# Altium project my_first_project.PrjPcb (part 2 of 3)

## Sheet Microcontroller.SchDoc
size A3; SheetNumber: 4; SheetTotal: 5; FIRST_PROJECT: *FIRST_PROJECT; PAGE_SİZE: *A3
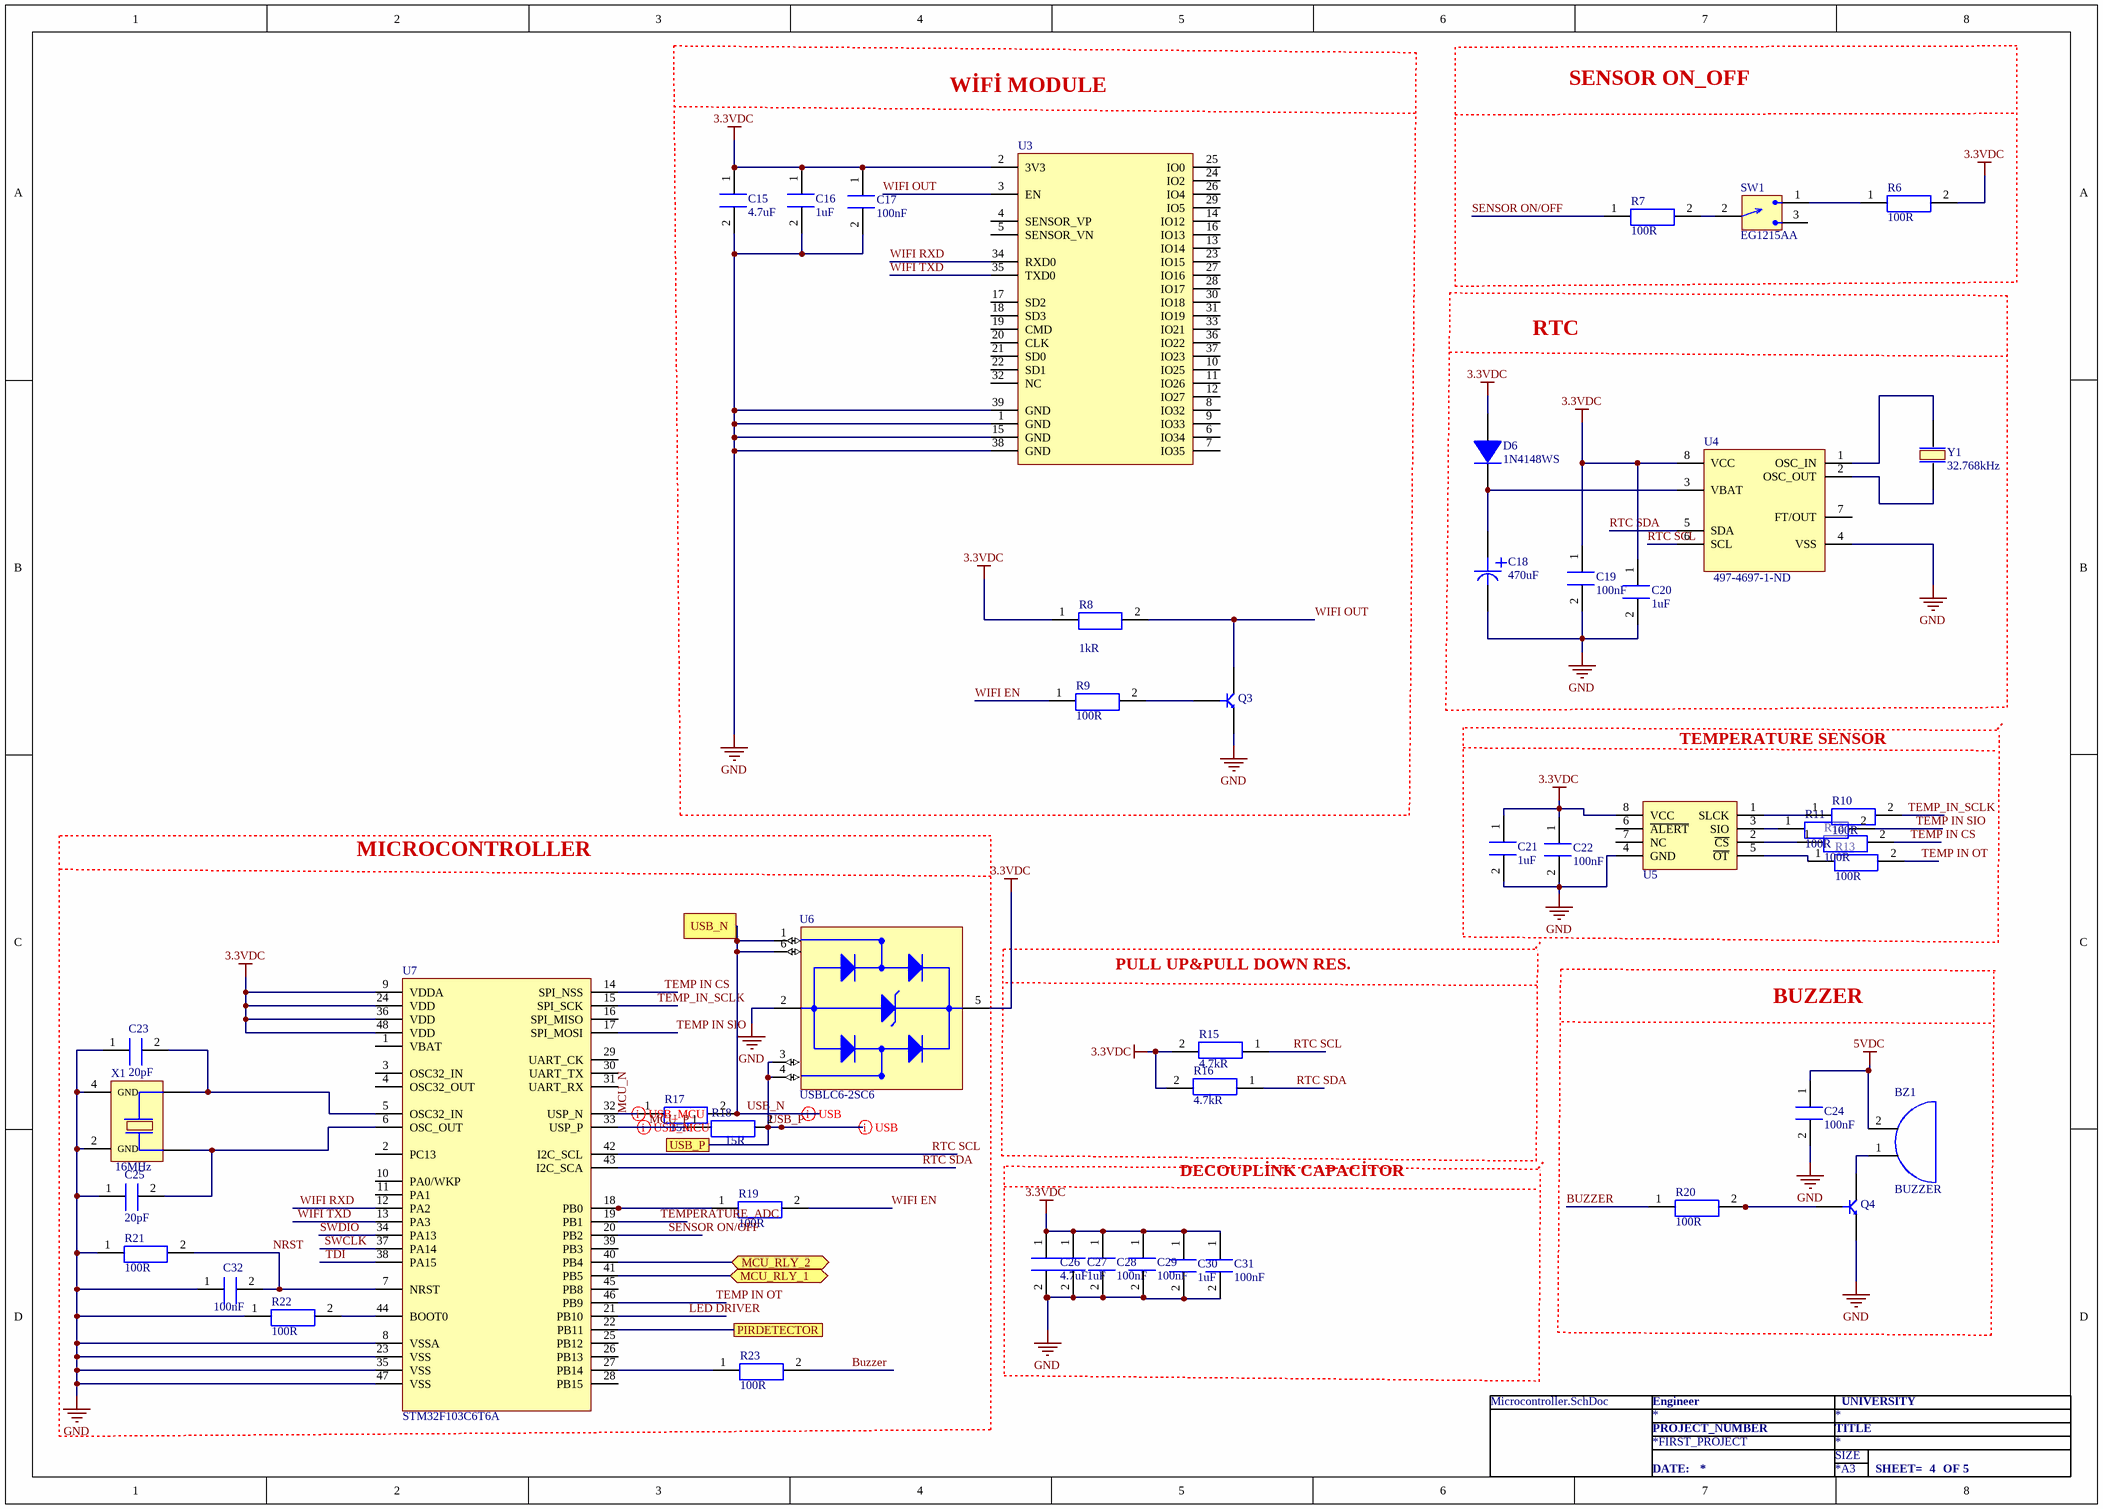
[diagram p3: Microcontroller.SchDoc]

### Parts
BZ1  BUZZER  [CMI-9605IC]
C15  Capacitance: 4.7uF  [CAP_0805]  (hidden comment: CAP CER 4.7uF 0805)
C16  Capacitance: 1uF  [CAP_0805]  (hidden comment: CAP CER 1UF 0805)
C17  Capacitance: 100nF  [CAP_0603]  (hidden comment: CAP CER 100nF 0603)
C18  Capacitance: 470uF  [CAP_RADIAL_D10_P5]  (hidden comment: ESH477M050AH4AA)
C19  Capacitance: 100nF  [CAP_0603]  (hidden comment: CAP CER 100nF 0603)
C20  Capacitance: 1uF  [CAP_0805]  (hidden comment: CAP CER 1UF 0805)
C21  Capacitance: 1uF  [CAP_0805]  (hidden comment: CAP CER 1UF 0805)
C22  Capacitance: 100nF  [CAP_0603]  (hidden comment: CAP CER 100nF 0603)
C23  Capacitance: 20pF  [CAP_0603]  (hidden comment: CL10C200JB8NNNC)
C24  Capacitance: 100nF  [CAP_0603]  (hidden comment: CAP CER 100nF 0603)
C25  Capacitance: 20pF  [CAP_0603]  (hidden comment: CL10C200JB8NNNC)
C26  Capacitance: 4.7uF  [CAP_0805]  (hidden comment: CAP CER 4.7uF 0805)
C27  Capacitance: 1uF  [CAP_0805]  (hidden comment: CAP CER 1UF 0805)
C28  Capacitance: 100nF  [CAP_0805]  (hidden comment: CAP CF 100NF 0805)
C29  Capacitance: 100nF  [CAP_0805]  (hidden comment: CAP CF 100NF 0805)
C30  Capacitance: 1uF  [CAP_0805]  (hidden comment: CAP CER 1UF 0805)
C31  Capacitance: 100nF  [CAP_0805]  (hidden comment: CAP CF 100NF 0805)
C32  Capacitance: 100nF  [CAP_0805]  (hidden comment: CAP CF 100NF 0805)
D6  1N4148WS  [SOD323]
Q3  MMBT3904-7-F  [SOT-23F]  (value not drawn)
Q4  MMBT3904-7-F  [SOT-23F]  (value not drawn)
R6  Resistance: 100R  [RES_0603]  (hidden comment: RES_100OHM_0603)
R7  Resistance: 100R  [RES_0603]  (hidden comment: RES_100OHM_0603)
R8  Resistance: 1kR  [RES_0603]  (hidden comment: RES_1KOHM)
R9  Resistance: 100R  [RES_0603]  (hidden comment: RES_100OHM_0603)
R10  Resistance: 100R  [RES_0603]  (hidden comment: RES_100OHM_0603)
R11  Resistance: 100R  [RES_0603]  (hidden comment: RES_100OHM_0603)
R12  Resistance: 100R  [RES_0603]  (hidden comment: RES_100OHM_0603)
R13  Resistance: 100R  [RES_0603]  (hidden comment: RES_100OHM_0603)
R15  Resistance: 4.7kR  [RES_0603]  (hidden comment: RES_4.7KOHM 0603)
R16  Resistance: 4.7kR  [RES_0603]  (hidden comment: RES_4.7KOHM 0603)
R17  Resistance: 15R  [RES_0603]  (hidden comment: RES 15 OHM 0603)
R18  Resistance: 15R  [RES_0603]  (hidden comment: RES 15 OHM 0603)
R19  Resistance: 100R  [RES_0603]  (hidden comment: RES_100OHM_0603)
R20  Resistance: 100R  [RES_0603]  (hidden comment: RES_100OHM_0603)
R21  Resistance: 100R  [RES_0603]  (hidden comment: RES_100OHM_0603)
R22  Resistance: 100R  [RES_0603]  (hidden comment: RES_100OHM_0603)
R23  Resistance: 100R  [RES_0603]  (hidden comment: RES_100OHM_0603)
SW1  EG1215AA  [EG1215AA]
U3  ESP32-WROOM-32E-N4  [ESP32-32E]  (value not drawn)
U4  Supplier Part Number 1: 497-4697-1-ND  [SOIC8]  (hidden comment: M41T00M6F)
U5  MAX662MSA+  [SOIC8]  (value not drawn)
U6  USBLC6-2SC6  [SOT-23-6L]
U7  STM32F103C6T6A  [LQFP_48]
X1  Frequency: 16MHz  [ECS]  (hidden comment: ECS-160-20-30B-TR)
Y1  Frequency: 32.768kHz  [ABS05]  (hidden comment: ABS05-32.768KHZ-T)

### Blocks framed on the sheet
WİFİ MODULE: C15-C17 Q3 R8 R9 U3
SENSOR ON_OFF: R6 R7 SW1
RTC: C18-C20 D6 U4 Y1
MICROCONTROLLER: C23 C25 C32 R17-R19 R21-R23 U6 U7 X1
BUZZER: BZ1 C24 Q4 R20

### Ports
MCU_RLY_1 (bidir), MCU_RLY_2 (bidir), PIRDETECTOR, USB_N, USB_P

### Nets
3.3VDC: C15.1 C16.1 C17.1 C19.1 C20.1 C21.1 C22.1 C26.1 C27.1 C28.1 C29.1 C30.1 C31.1 D6.2 R6.2 R8.1 R15.2 R16.2 U3.2(3V3) U4.8(VCC) U5.8(VCC) U6.5(VBUS) U7.9(VDDA) U7.24(VDD) U7.36(VDD) U7.48(VDD)
5VDC: BZ1.2(GND) C24.1
GND: C15.2 C16.2 C17.2 C18.2 C19.2 C20.2 C21.2 C22.2 C23.1 C24.2 C25.1 C26.2 C27.2 C28.2 C29.2 C30.2 C31.2 C32.1 Q3.2(E) Q4.2(E) R21.1 R22.1 U3.1(GND) U3.15(GND) U3.38(GND) U3.39(GND) U4.4(VSS) U5.4(GND) U6.2(GND) U7.8(VSSA) U7.23(VSS) U7.35(VSS) U7.47(VSS) X1.2(GND) X1.4(GND)
BUZZER: R20.1 R23.2
LED DRIVER: U7.21(PB10)
MCU_N: R17.1 U7.32(USP_N)
MCU_P: R18.1 U7.33(USP_P)
NRST: C32.2 R21.2 U7.7(NRST)
RTC SCL: R15.1 U4.6(SCL) U7.42(I2C_SCL)
RTC SDA: R16.1 U4.5(SDA) U7.43(I2C_SCA)
SENSOR ON/OFF: R7.1 U7.20(PB2)
SWCLK: U7.37(PA14)
SWDIO: U7.34(PA13)
TDI: U7.38(PA15)
TEMP IN CS: R12.2 U7.14(SPI_NSS)
TEMP IN OT: R13.2 U7.46(PB9)
TEMP IN SIO: R11.2 U7.17(SPI_MOSI)
TEMP_IN_SCLK: R10.2 U7.15(SPI_SCK)
TEMPERATURE_ADC: U7.19(PB1)
USB_N: R17.2 U6.1(I/O1_IN) U6.6(I/O1_OUT) ; port USB_N
USB_P: R18.2 U6.3(I/O2_IN) U6.4(I/O2_OUT) ; port USB_P
WIFI EN: R9.1 R19.2
WIFI OUT: Q3.3(C) R8.2 U3.3(EN)
WIFI RXD: U3.34(RXD0) U7.12(PA2)
WIFI TXD: U3.35(TXD0) U7.13(PA3)
NetBZ1_1: BZ1.1(VDC) Q4.3(C)
NetC18_1: C18.1 D6.1 U4.3(VBAT)
NetC23_2: C23.2 U7.5(OSC32_IN) X1.3
NetC25_2: C25.2 U7.6(OSC_OUT) X1.1
NetJ8_5: U7.22(PB11) ; port PIRDETECTOR
NetQ3_1: Q3.1(B) R9.2
NetQ4_1: Q4.1(B) R20.2
NetR2_1: U7.41(PB5) ; port MCU_RLY_1
NetR4_1: U7.40(PB4) ; port MCU_RLY_2
NetR6_1: R6.1 SW1.1
NetR7_2: R7.2 SW1.2
NetR10_1: R10.1 U5.1(SLCK)
NetR11_1: R11.1 U5.3(SIO)
NetR12_1: R12.1 U5.2(~{CS})
NetR13_1: R13.1 U5.5(~{OT})
NetR19_1: R19.1 U7.18(PB0)
NetR22_2: R22.2 U7.44(BOOT0)
NetR23_1: R23.1 U7.27(PB14)
NetU4_1: U4.1(OSC_IN) Y1.2
NetU4_2: U4.2(OSC_OUT) Y1.1

Not connected (* = marked no-connect by the designer): SW1 3; U3 4(SENSOR_VP) 5(SENSOR_VN) 6(IO34) 7(IO35) 8(IO32) 9(IO33) 10(IO25) 11(IO26) 12(IO27) 13(IO14) 14(IO12) 16(IO13) 17(SD2) 18(SD3) 19(CMD) 20(CLK) 21(SD0) 22(SD1) 23(IO15) 24(IO2) 25(IO0) 26(IO4) 27(IO16) 28(IO17) 29(IO5) 30(IO18) 31(IO19) 32(NC) 33(IO21) 36(IO22) 37(IO23); U4 7(FT/OUT); U5 6(~{ALERT}) 7(NC); U7 1(VBAT) 2(PC13) 3(OSC32_IN) 4(OSC32_OUT) 10(PA0/WKP) 11(PA1) 16(SPI_MISO) 25(PB12) 26(PB13) 28(PB15) 29(UART_CK) 30(UART_TX) 31(UART_RX) 39(PB3) 45(PB8)

### Layout directives
differential pair: MCU_N, MCU_P, USB_N, USB_P

### Notes on the sheet
- TEMPERATURE SENSOR
- PULL UP&PULL DOWN RES.
- DECOUPLİNK CAPACİTOR
- Engineer
- PROJECT_NUMBER
- SIZE
- TITLE
- UNIVERSITY
- DATE:
- SHEET=
- OF

### Library data of the parts
BZ1 = BUZZER: Audio Buzzer Magnetic 3VDC 7VDC 30mA 5VDC 85dB 2600Hz to 2800Hz Through Hole Pin Box; Manufacturer: CUI Devices; Manufacturer Part Number: CMI-9605IC-0580T; this part is design: alperen; Supplier 1: Digi-Key; RoHS: No; Category: Audio Products; Stock 1: 8015; Pricing 1: 1=1.43000, 10=1.19000, 25=1.10160, 50=1.03700, 100=0.97450, 500=0.83848, 1000=0.78382, 5000=0.76810 (USD); Supplier Part Number 1: 2223-CMI-9605IC-0580T-ND; Case/Package: CMI-960
C15 C26 = CAP CER 4.7uF 0805: CAP CER 4.7UF 25V X5R 0805; Manufacturer: Samsung; Manufacturer Part Number: CL21A475KAQNNNE; this part is design: alperen; Tolerance: 10%; Supplier 1: Digi-Key; RoHS: Yes; Category: Ceramic Capacitors; Stock 1: 4696474; Pricing 1: 1=0.10000, 10=0.07300, 50=0.04140, 100=0.03440, 500=0.02408, 1000=0.01994 (USD); Mount: Surface Mount; Case/Package: 0805; Case Code (Metric): 2012; Case Code (Imperial): 0805; Min Operating Temperature: -55°C; Max Operating Temperature: 85°C; Package Quantity: 1; Packaging: Tape and Reel; Voltage Rating: 25V; Dielectric: X5R; Voltage Rating (DC): 25V; Series: CL; Construction: Flat; Length: 2mm; Width: 0.049inch; Height: 1.25mm; Thickness: 0.055inch; Depth: 1.25mm; Radiation Hardening: No; Lead Free: Lead Free; RoHS Compliant: Yes; ComponentLink1URL: https://datasheet.ciiva.com/25798/cl21a475kaqnnne-25798882.pdf?src-supplier=Digi-Key; ComponentLink1Description: https://datasheet.ciiva.com/25798/cl21a475kaqnnne-25798882.pdf?src-supplier=Digi-Key; Supplier Part Number 1: 1276-1244-6-ND
C16 C20 C21 C27 C30 = CAP CER 1UF 0805: CAP CER 1UF 25V X5R 0805; Manufacturer: Murata; Manufacturer Part Number: GRM216R61E105KA12D; this part is design: alperen; Material: Ceramic; Tolerance: 10%; Supplier 1: Digi-Key; RoHS: Yes; Category: Ceramic Capacitors; Stock 1: 601950; Pricing 1: 1=0.38000, 10=0.26600, 50=0.18640, 100=0.15970, 500=0.11980, 1000=0.10116 (USD); Mount: Surface Mount; Case/Package: 0805; Number of Pins: 2; Case Code (Imperial): 0805; Case Code (Metric): 2012; Min Operating Temperature: -55°C; Max Operating Temperature: 85°C; Voltage Rating: 25V; Packaging: Tape and Reel; Dielectric: X5R; Package Quantity: 1; Termination: SMD/SMT; Voltage Rating (DC): 25V; Series: GRM; Construction: Flat; Voltage: 25V; Length: 2mm; Width: 1.25mm; Height: 0.6mm; Thickness: 0.028inch; Depth: 1.25mm; Radiation Hardening: No; RoHS Compliant: Yes; Lead Free: Lead Free; Reach SVHC Compliant: Yes; ComponentLink1URL: https://datasheet.ciiva.com/5424/product-5424880.pdf?src-supplier=Mouser; ComponentLink1Description: https://datasheet.ciiva.com/5424/product-5424880.pdf?src-supplier=Mouser; ComponentLink2URL: https://datasheet.ciiva.com/3777/337grm216r61e105ka1223-3777289.pdf?src-supplier=Arrow+Electronics; ComponentLink2Description: https://datasheet.ciiva.com/3777/337grm216r61e105ka1223-3777289.pdf?src-supplier=Arrow+Electronics; ComponentLink3URL: https://datasheet.ciiva.com/11787/0900766b80ef921d-11787891.pdf?src-supplier=Rs; ComponentLink3Description: https://datasheet.ciiva.com/11787/0900766b80ef921d-11787891.pdf?src-supplier=Rs; ComponentLink4URL: https://datasheet.ciiva.com/7719/c02e-7719049.pdf?src-supplier=Element14; ComponentLink4Description: https://datasheet.ciiva.com/7719/c02e-7719049.pdf?src-supplier=Element14; ComponentLink5URL: https://datasheet.ciiva.com/22706/1889704-22706791.pdf?src-supplier=Element14; ComponentLink5Description: https://datasheet.ciiva.com/22706/1889704-22706791.pdf?src-supplier=Element14; ComponentLink6URL: https://datasheet.ciiva.com/138/partnumbering-e-01-138518.pdf?src-supplier=Digi-Key; ComponentLink6Description: https://datasheet.ciiva.com/138/partnumbering-e-01-138518.pdf?src-supplier=Digi-Key; ComponentLink7URL: https://datasheet.ciiva.com/138/partnumbering-e-01-138517.pdf?src-supplier=Digi-Key; ComponentLink7Description: https://datasheet.ciiva.com/138/partnumbering-e-01-138517.pdf?src-supplier=Digi-Key; ComponentLink8URL: https://datasheet.ciiva.com/138/partnumbering-e-01-138519.pdf?src-supplier=Digi-Key; ComponentLink8Description: https://datasheet.ciiva.com/138/partnumbering-e-01-138519.pdf?src-supplier=Digi-Key; ComponentLink9URL: https://datasheet.ciiva.com/2989/product-2989638.pdf?src-supplier=Avnet; ComponentLink9Description: https://datasheet.ciiva.com/2989/product-2989638.pdf?src-supplier=Avnet; Supplier Part Number 1: 490-1700-1-ND
C17 C19 C22 C24 = CAP CER 100nF 0603: Multilayer Ceramic Capacitor, 0.1 uF, 10 V, ± 10%, X5R, 0402 [1005 Metric] %10; this part is design: alperen; Manufacturer: KEMET; Manufacturer Part Number: C0402C104K8PACTU; Voltage Rating: 10V; Dissipation Factor: 5%; Supplier 1: Digi-Key; RoHS: Yes; Category: Ceramic Capacitors; Stock 1: 2730000; Pricing 1: 10000=0.00702, 20000=0.00669, 30000=0.00635, 50000=0.00568, 100000=0.00460 (USD); Mount: Surface Mount,PCB; Case/Package: 0402; Number of Pins: 2; Case Code (Metric): 1005; Case Code (Imperial): 0402; Dielectric Material: Ceramic; Contact Plating: Tin,Matte; Min Operating Temperature: -55°C; Max Operating Temperature: 85°C; Tolerance: 10%; Voltage Rating (DC): 10V; Package Quantity: 10000; Packaging: Tape and Reel; Termination: SMD/SMT; Voltage: 10V; Series: SMD Comm X5R; Construction: Flat; Dielectric: X5R; Length: 1mm; Width: 0.5mm; Height: 0.5mm; Depth: 0.5mm; Thickness: 0.022inch; Lead Pitch: 0.3mm; Radiation Hardening: No; RoHS Compliant: Yes; Reach SVHC Compliant: Yes; Lead Free: Lead Free; Supplier Part Number 1: 399-C0402C104K8PAC7867TR-ND
C18 = ESH477M050AH4AA: Cap, 470UF, 50V, Alu Elec, Radial; Manufacturer: KEMET; this part is design: alperen; Polarity: Polar; Tolerance: 20%; Life (Hours): 2000Hour; Supplier 1: Digi-Key; Manufacturer Part Number: ESH477M050AH4AA; RoHS: Yes; Pricing 1: 1=0.73000, 10=0.51800, 50=0.39180, 100=0.34120, 500=0.25276, 1000=0.21485, 2500=0.20222, 5000=0.18958 (USD); Mount: Through Hole; Case/Package: Radial; Min Operating Temperature: -40°C; Max Operating Temperature: 105°C; Packaging: Bulk; Voltage Rating: 50V; RoHS Compliant: No; ComponentLink1URL: https://api.kemet.com/component-edge/download/datasheet/ESH477M050AH4AA.pdf?src-supplier=Digi-Key; ComponentLink1Description: https://api.kemet.com/component-edge/download/datasheet/ESH477M050AH4AA.pdf?src-supplier=Digi-Key; Supplier Part Number 1: 399-15683-ND
C23 C25 = CAP CER 20pF 0603: CAP CER 20PF 50V C0G/NP0 0603; this part is designed: alperen; Manufacturer: Samsung; Tolerance: 5%; Dielectric: C0G; Temperature Coefficient: 300ppm/°C; Supplier 1: Digi-Key; Manufacturer Part Number: CL10C200JB8NNNC; RoHS: Yes; Category: Ceramic Capacitors; Stock 1: 512055; Pricing 1: 1=0.10000, 10=0.04400, 50=0.02380, 100=0.01940, 500=0.01386, 1000=0.01089 (USD); Mount: Surface Mount; Case/Package: 0603; Case Code (Metric): 1608; Case Code (Imperial): 0603; Min Operating Temperature: -55°C; Max Operating Temperature: 125°C; Package Quantity: 1; Packaging: Tape and Reel; Voltage Rating: 50V; Voltage: 50V; Series: CL; Construction: Flat; Length: 1.6mm; Width: 0.031inch; Height: 0.8mm; Thickness: 0.035inch; Depth: 0.8mm; Radiation Hardening: No; RoHS Compliant: Yes; ComponentLink1URL: https://datasheet.ciiva.com/26877/getdatasheetpartid-640634-26877974.pdf?src-supplier=Verical; ComponentLink1Description: https://datasheet.ciiva.com/26877/getdatasheetpartid-640634-26877974.pdf?src-supplier=Verical; ComponentLink2URL: https://datasheet.ciiva.com/26310/mlcc-catalogdownload2013-eng-26310315.pdf?src-supplier=Distrelec; ComponentLink2Description: https://datasheet.ciiva.com/26310/mlcc-catalogdownload2013-eng-26310315.pdf?src-supplier=Distrelec; Supplier Part Number 1: 1276-1187-1-ND
C28 C29 C31 C32 = CAP CF 100NF 0805: CAP CER 0.1UF 50V X7R 0805; Manufacturer: Samsung; Manufacturer Part Number: CL21B104KBCNNNC; this part is design: alperen; Material: Ceramic; Tolerance: 10%; Supplier 1: Digi-Key; RoHS: Yes; Category: Ceramic Capacitors; Stock 1: 3449370; Pricing 1: 1=0.10000, 10=0.04400, 50=0.02400, 100=0.01960, 500=0.01404, 1000=0.01103 (USD); Mount: Surface Mount; Case/Package: 0805; Case Code (Metric): 2012; Case Code (Imperial): 0805; Contact Plating: Tin; Min Operating Temperature: -55°C; Max Operating Temperature: 125°C; Dielectric: X7R; Packaging: Tape and Reel; Voltage Rating: 50V; Voltage: 50V; Voltage Rating (DC): 50V; Series: CL; Construction: Flat; Length: 2mm; Width: 0.049inch; Height: 0.85mm; Depth: 1.25mm; Thickness: 0.037inch; Radiation Hardening: No; Lead Free: Lead Free; RoHS Compliant: Yes; ComponentLink1URL: https://datasheet.ciiva.com/25710/cl21b104kbcnnnc-25710182.pdf?src-supplier=Digi-Key; ComponentLink1Description: https://datasheet.ciiva.com/25710/cl21b104kbcnnnc-25710182.pdf?src-supplier=Digi-Key; ComponentLink2URL: https://datasheet.ciiva.com/29199/454152-da-01-en-vs-kondensator-0805-29199814.pdf?src-supplier=Conrad; ComponentLink2Description: https://datasheet.ciiva.com/29199/454152-da-01-en-vs-kondensator-0805-29199814.pdf?src-supplier=Conrad; Supplier Part Number 1: 1276-1003-1-ND
D6 = 1N4148WS: VR=75V IF=150mA Trr=4ns P=200mW; Manufacturer: ON Semiconductor / Fairchild; this part is design: alperen; Forward Current: 150mA; Reverse Recovery Time: 4ns; Max Repetitive Reverse Voltage (Vrrm): 75V; Power Dissipation: 200mW; Max Reverse Current: 5uA; Forward Voltage: 1V; Max Forward Surge Current (Ifsm): 2A; Element Configuration: Single; Supplier 1: Digi-Key; Manufacturer Part Number: 1N4148WS; RoHS: Yes; Category: Rectifier Diodes; Stock 1: 878888; Pricing 1: 1=0.21000, 10=0.19200, 100=0.10460, 500=0.06436, 1000=0.04388 (USD); Mount: Surface Mount; Number of Pins: 2; Contact Plating: Tin,Matte; Weight: 0.0276g; Min Operating Temperature: -55°C; Max Operating Temperature: 150°C; Packaging: Tape and Reel; Package Quantity: 1; Recovery Time: 4ns; Average Rectified Current: 150mA; Reverse Voltage: 75V; Max Reverse Voltage (DC): 75V; Series: -; Length: 1.8mm; Width: 1.35mm; Height: 1mm; Radiation Hardening: No; Reach SVHC Compliant: Yes; Lead Free: Lead Free; RoHS Compliant: Yes; ComponentLink1URL: https://datasheet.ciiva.com/15208/getdatasheetpartid-127819-15208358.pdf?src-supplier=Verical; ComponentLink1Description: https://datasheet.ciiva.com/15208/getdatasheetpartid-127819-15208358.pdf?src-supplier=Verical; ComponentLink2URL: https://datasheet.ciiva.com/8300/1n914bws-8300360.pdf?src-supplier=Avnet; ComponentLink2Description: https://datasheet.ciiva.com/8300/1n914bws-8300360.pdf?src-supplier=Avnet; Supplier Part Number 1: 1N4148WSFSCT-ND
Q3 Q4 = MMBT3904-7-F: NPN Ic=200mA Vceo=40V hfe=100~300 fT=310MHz P=300mW SOT-23; this part is designed: alperen; Manufacturer: Diodes Zetex; Max Power Dissipation: 300mW; Collector Emitter Voltage (VCEO): 40V; Max Collector Current: 200mA; Collector Base Voltage (VCBO): 60V; Power Dissipation: 350mW; Frequency: 300MHz; hFE Min: 100; Number of Elements: 1; Emitter Base Voltage (VEBO): 6V; Collector Emitter Saturation Voltage: 300mV; Element Configuration: Single; Supplier 1: Digi-Key; Manufacturer Part Number: MMBT3904-7-F; RoHS: Yes; Category: BJTs; Stock 1: 7702566; Pricing 1: 1=0.13000, 10=0.11700, 100=0.06370, 500=0.03918, 1000=0.02671 (USD); Mount: Surface Mount; Case/Package: SOT-23; Number of Pins: 3; Weight: 0.000282oz; Contact Plating: Tin,Matte; Min Operating Temperature: -55°C; Max Operating Temperature: 150°C; Polarity: NPN; Packaging: Tape and Reel; Package Quantity: 3000; Transition Frequency: 300MHz; Collector Emitter Breakdown Voltage: 40V; Max Breakdown Voltage: 40V; Continuous Collector Current: 200mA; Max Frequency: 300MHz; Gain Bandwidth Product: 300MHz; Voltage Rating (DC): 40V; Series: Automotive, AEC-Q101; Collector-emitter Voltage-Max: 300mV; Length: 3.05mm; Width: 1.4mm; Height: 1mm; Radiation Hardening: No; Reach SVHC Compliant: Yes; Lead Free: Lead Free; RoHS Compliant: Yes; ComponentLink1URL: https://datasheet.ciiva.com/11201/ds30036-11201778.pdf?src-supplier=Avnet; ComponentLink1Description: https://datasheet.ciiva.com/11201/ds30036-11201778.pdf?src-supplier=Avnet; ComponentLink2URL: https://datasheet.ciiva.com/15138/getdatasheetpartid-53265-15138780.pdf?src-supplier=Verical; ComponentLink2Description: https://datasheet.ciiva.com/15138/getdatasheetpartid-53265-15138780.pdf?src-supplier=Verical; ComponentLink3URL: https://datasheet.ciiva.com/22711/1915516-22711750.pdf?src-supplier=Element14; ComponentLink3Description: https://datasheet.ciiva.com/22711/1915516-22711750.pdf?src-supplier=Element14; ComponentLink4URL: https://datasheet.ciiva.com/11198/ds30036-11198999.pdf?src-supplier=Avnet; ComponentLink4Description: https://datasheet.ciiva.com/11198/ds30036-11198999.pdf?src-supplier=Avnet; ComponentLink5URL: https://datasheet.ciiva.com/6361/ds30036-6361256.pdf?src-supplier=Digi-Key; ComponentLink5Description: https://datasheet.ciiva.com/6361/ds30036-6361256.pdf?src-supplier=Digi-Key; ComponentLink6URL: https://datasheet.ciiva.com/6361/ds30036-6361254.pdf?src-supplier=Digi-Key; ComponentLink6Description: https://datasheet.ciiva.com/6361/ds30036-6361254.pdf?src-supplier=Digi-Key; Supplier Part Number 1: MMBT3904-FDICT-ND
R6 R7 R9-R13 R19-R23 = RES_100OHM_0603: Res Thick Film 0603 100 Ohm 1% 1/10W ±100ppm/°C Molded SMD Paper T/R; this part is design: alperen; Manufacturer: Vishay Dale; Manufacturer Part Number: CRCW0603100RFKEA; Max Power Dissipation: 100mW; Voltage Rating: 75V; Supplier 1: Digi-Key; RoHS: Yes; Category: Chip SMD Resistors; Stock 1: 9146; Pricing 1: 1=0.10000, 10=0.03800, 100=0.01560, 1000=0.00701, 2500=0.00608 (USD); Mount: Surface Mount; Case/Package: 0603; Number of Pins: 2; Case Code (Metric): 1608; Case Code (Imperial): 0603; Contact Plating: Tin; Size Code: 0603; Weight: 7.1E-05oz; Min Operating Temperature: -55°C; Max Operating Temperature: 155°C; Packaging: Tape and Reel; Temperature Coefficient: 100ppm/°C; Tolerance: 1%; Series: CRCW; Resistor Type: Thick Film; Number of Terminations: 2; Power Rating: 100mW; Features: Automotive AEC-Q200; Construction: Rectangular; Termination: SMD/SMT; Package Quantity: 10; Voltage Rating (DC): 75V; Resistance Tolerance: 1%; Length: 1.55mm; Width: 0.033inch; Height: 0.02inch; Depth: 0.85mm; Ratings: AEC-Q200; Radiation Hardening: No; RoHS Compliant: Yes; Military Standard: Not; Lead Free: Lead Free; ComponentLink1URL: https://datasheet.ciiva.com/22666/1720486-22666207.pdf?src-supplier=Element14; ComponentLink1Description: https://datasheet.ciiva.com/22666/1720486-22666207.pdf?src-supplier=Element14; ComponentLink2URL: https://datasheet.ciiva.com/26316/fld-crcw-e3-data-en-26316566.pdf?src-supplier=Distrelec; ComponentLink2Description: https://datasheet.ciiva.com/26316/fld-crcw-e3-data-en-26316566.pdf?src-supplier=Distrelec; ComponentLink3URL: https://datasheet.ciiva.com/22673/1697337-22673066.pdf?src-supplier=Element14; ComponentLink3Description: https://datasheet.ciiva.com/22673/1697337-22673066.pdf?src-supplier=Element14; ComponentLink4URL: https://datasheet.ciiva.com/2465/dcrcwe3-2465544.pdf?src-supplier=Digi-Key; ComponentLink4Description: https://datasheet.ciiva.com/2465/dcrcwe3-2465544.pdf?src-supplier=Digi-Key; ComponentLink5URL: https://datasheet.ciiva.com/2465/dcrcwe3-2465545.pdf?src-supplier=Digi-Key; ComponentLink5Description: https://datasheet.ciiva.com/2465/dcrcwe3-2465545.pdf?src-supplier=Digi-Key; ComponentLink6URL: https://datasheet.ciiva.com/2465/dcrcwe3-2465543.pdf?src-supplier=Digi-Key; ComponentLink6Description: https://datasheet.ciiva.com/2465/dcrcwe3-2465543.pdf?src-supplier=Digi-Key; ComponentLink7URL: https://datasheet.ciiva.com/16721/70201119-16721486.pdf?src-supplier=Allied+Electronics; ComponentLink7Description: https://datasheet.ciiva.com/16721/70201119-16721486.pdf?src-supplier=Allied+Electronics; ComponentLink8URL: https://datasheet.ciiva.com/16787/70201119-16787964.pdf?src-supplier=Allied+Electronics; ComponentLink8Description: https://datasheet.ciiva.com/16787/70201119-16787964.pdf?src-supplier=Allied+Electronics; ComponentLink9URL: https://datasheet.ciiva.com/5550/dcrcwe3-109170-5550286.pdf?src-supplier=Mouser; ComponentLink9Description: https://datasheet.ciiva.com/5550/dcrcwe3-109170-5550286.pdf?src-supplier=Mouser; ComponentLink10URL: https://datasheet.ciiva.com/16199/dcrcwe3-16199102.pdf?src-supplier=Future+Electronics; ComponentLink10Description: https://datasheet.ciiva.com/16199/dcrcwe3-16199102.pdf?src-supplier=Future+Electronics; Supplier Part Number 1: 541-100HCT-ND
R8 = RES_1KOHM: Res Thin Film 0603 1K Ohm 0.1% 1/10W ±25ppm/°C Molded SMD SMD Punched Carrier T/R; this part is designed: alperen; Manufacturer: Panasonic; Manufacturer Part Number: ERA-3AEB102V; Power Rating: 100mW; Voltage Rating: 75V; Supplier 1: Digi-Key; RoHS: Yes; Category: Chip SMD Resistors; Stock 1: 5000; Pricing 1: 1=0.35000, 10=0.29900, 100=0.11670, 500=0.07056, 1000=0.04885, 2500=0.04478 (USD); Mount: Surface Mount; Case/Package: 0603; Number of Pins: 2; Case Code (Imperial): 0603; Case Code (Metric): 1608; Contact Plating: Tin; Size Code: 0603; Min Operating Temperature: -55°C; Max Operating Temperature: 155°C; Packaging: Tape and Reel; Temperature Coefficient: 25ppm/°C; Series: ERA-3A; Tolerance: 0.1%; Resistor Type: Thin Film; Number of Terminations: 2; Max Power Dissipation: 100mW; Construction: Rectangular; Features: Automotive AEC-Q200; Package Quantity: 5000; Termination: SMD/SMT; Resistance Tolerance: 0.1%; Technology: METAL FILM; Length: 1.6mm; Width: 0.8mm; Height: 0.45mm; Depth: 0.8mm; Ratings: AEC-Q200; Radiation Hardening: No; RoHS Compliant: Yes; Military Standard: Not; Reach SVHC Compliant: Yes; ComponentLink1URL: https://datasheet.ciiva.com/29183/450752-da-01-en-widerstand-0603-era-29183754.pdf?src-supplier=Conrad; ComponentLink1Description: https://datasheet.ciiva.com/29183/450752-da-01-en-widerstand-0603-era-29183754.pdf?src-supplier=Conrad; ComponentLink2URL: https://datasheet.ciiva.com/46393/1776116-46393695.pdf?src-supplier=Element14; ComponentLink2Description: https://datasheet.ciiva.com/46393/1776116-46393695.pdf?src-supplier=Element14; ComponentLink3URL: https://datasheet.ciiva.com/5734/aoa0000ce26-5734524.pdf?src-supplier=Farnell; ComponentLink3Description: https://datasheet.ciiva.com/5734/aoa0000ce26-5734524.pdf?src-supplier=Farnell; ComponentLink4URL: https://datasheet.ciiva.com/46422/1776116-46422455.pdf?src-supplier=Element14; ComponentLink4Description: https://datasheet.ciiva.com/46422/1776116-46422455.pdf?src-supplier=Element14; ComponentLink5URL: https://datasheet.ciiva.com/48530/era-eng-tds-48530582.pdf?src-supplier=Distrelec; ComponentLink5Description: https://datasheet.ciiva.com/48530/era-eng-tds-48530582.pdf?src-supplier=Distrelec; ComponentLink6URL: https://datasheet.ciiva.com/46422/485442-46422519.pdf?src-supplier=Element14; ComponentLink6Description: https://datasheet.ciiva.com/46422/485442-46422519.pdf?src-supplier=Element14; ComponentLink7URL: https://datasheet.ciiva.com/5734/485442-5734525.pdf?src-supplier=Farnell; ComponentLink7Description: https://datasheet.ciiva.com/5734/485442-5734525.pdf?src-supplier=Farnell; ComponentLink8URL: https://datasheet.ciiva.com/28531/485442-28531944.pdf?src-supplier=Element14; ComponentLink8Description: https://datasheet.ciiva.com/28531/485442-28531944.pdf?src-supplier=Element14; ComponentLink9URL: https://datasheet.ciiva.com/24071/aoa0000ce26-197354-24071510.pdf?src-supplier=Mouser; ComponentLink9Description: https://datasheet.ciiva.com/24071/aoa0000ce26-197354-24071510.pdf?src-supplier=Mouser; ComponentLink10URL: https://datasheet.ciiva.com/16781/70068849-16781703.pdf?src-supplier=Allied+Electronics; ComponentLink10Description: https://datasheet.ciiva.com/16781/70068849-16781703.pdf?src-supplier=Allied+Electronics; ComponentLink11URL: https://datasheet.ciiva.com/16725/70068849-16725038.pdf?src-supplier=Allied+Electronics; ComponentLink11Description: https://datasheet.ciiva.com/16725/70068849-16725038.pdf?src-supplier=Allied+Electronics; ComponentLink12URL: https://datasheet.ciiva.com/9198/aoa0000ce26-9198972.pdf?src-supplier=Avnet; ComponentLink12Description: https://datasheet.ciiva.com/9198/aoa0000ce26-9198972.pdf?src-supplier=Avnet; ComponentLink13URL: https://datasheet.ciiva.com/16426/aoa0000ce26-16426809.pdf?src-supplier=Future+Electronics; ComponentLink13Description: https://datasheet.ciiva.com/16426/aoa0000ce26-16426809.pdf?src-supplier=Future+Electronics; Supplier Part Number 1: P1.0KDBCT-ND
R15 R16 = RES_4.7KOHM 0603: Res Thick Film 0603 4.7K Ohm 1% 1/10W ±100ppm/°C Molded SMD Punched Carrier T/R; Manufacturer: Panasonic; Manufacturer Part Number: ERJ-3EKF4701V; this part is design: alperen; Max Power Dissipation: 100mW; Voltage Rating (DC): 75V; Supplier 1: Digi-Key; RoHS: Yes; Category: Chip SMD Resistors; Stock 1: 2925070; Pricing 1: 1=0.10000, 10=0.05000, 100=0.02020, 1000=0.00907, 2500=0.00787 (USD); Mount: Surface Mount; Case/Package: 0603; Number of Pins: 2; Case Code (Metric): 1608; Case Code (Imperial): 0603; Contact Plating: Tin; Size Code: 0603; Weight: 7.1E-05oz; Min Operating Temperature: -55°C; Max Operating Temperature: 155°C; Tolerance: 1%; Packaging: Tape and Reel; Temperature Coefficient: 100ppm/°C; Resistor Type: Thick Film; Series: ERJ; Number of Terminations: 2; Power Rating: 100mW; Features: Automotive AEC-Q200; Package Quantity: 1; Voltage Rating: 75V; Construction: Rectangular; Termination: SMD/SMT; Resistance Tolerance: 1%; Length: 1.6mm; Width: 0.8mm; Height: 0.022inch; Depth: 0.8mm; Radiation Hardening: No; RoHS Compliant: Yes; Lead Free: Lead Free; Military Standard: Not; Reach SVHC Compliant: Yes; ComponentLink1URL: https://datasheet.ciiva.com/7830/aoa0000ce2-7830735.pdf?src-supplier=Element14; ComponentLink1Description: https://datasheet.ciiva.com/7830/aoa0000ce2-7830735.pdf?src-supplier=Element14; ComponentLink2URL: https://datasheet.ciiva.com/7830/426256-7830985.pdf?src-supplier=Element14; ComponentLink2Description: https://datasheet.ciiva.com/7830/426256-7830985.pdf?src-supplier=Element14; ComponentLink3URL: https://datasheet.ciiva.com/46372/1678782-46372716.pdf?src-supplier=Element14; ComponentLink3Description: https://datasheet.ciiva.com/46372/1678782-46372716.pdf?src-supplier=Element14; ComponentLink4URL: https://datasheet.ciiva.com/46372/1678782-46372717.pdf?src-supplier=Element14; ComponentLink4Description: https://datasheet.ciiva.com/46372/1678782-46372717.pdf?src-supplier=Element14; ComponentLink5URL: https://datasheet.ciiva.com/24160/aoa0000ce2-24160445.pdf?src-supplier=Mouser; ComponentLink5Description: https://datasheet.ciiva.com/24160/aoa0000ce2-24160445.pdf?src-supplier=Mouser; ComponentLink6URL: https://datasheet.ciiva.com/16758/70260748-16758189.pdf?src-supplier=Allied+Electronics; ComponentLink6Description: https://datasheet.ciiva.com/16758/70260748-16758189.pdf?src-supplier=Allied+Electronics; ComponentLink7URL: https://datasheet.ciiva.com/9195/aoa0000ce2-9195740.pdf?src-supplier=Avnet; ComponentLink7Description: https://datasheet.ciiva.com/9195/aoa0000ce2-9195740.pdf?src-supplier=Avnet; ComponentLink8URL: https://datasheet.ciiva.com/16449/aoa0000ce2-16449479.pdf?src-supplier=Future+Electronics; ComponentLink8Description: https://datasheet.ciiva.com/16449/aoa0000ce2-16449479.pdf?src-supplier=Future+Electronics; Supplier Part Number 1: P4.70KHCT-ND
R17 R18 = RES 15 OHM 0603: Res Thick Film 0603 15 Ohm 1% 1/10W ±100ppm/°C Molded SMD Punched Carrier T/R; this part is designed: alperen; Manufacturer: Panasonic; Manufacturer Part Number: ERJ-3EKF15R0V; Max Power Dissipation: 100mW; Voltage Rating (DC): 75V; Supplier 1: Digi-Key; RoHS: Yes; Category: Chip SMD Resistors; Stock 1: 151082; Pricing 1: 1=0.10000, 10=0.05000, 100=0.02020, 1000=0.00907, 2500=0.00787 (USD); Mount: Surface Mount; Case/Package: 0603; Number of Pins: 2; Case Code (Metric): 1608; Case Code (Imperial): 0603; Contact Plating: Tin; Weight: 7.1E-05oz; Min Operating Temperature: -55°C; Max Operating Temperature: 155°C; Packaging: Tape and Reel; Tolerance: 1%; Number of Terminations: 2; Temperature Coefficient: 100ppm/°C; Resistor Type: Thick Film; Series: ERJ; Power Rating: 100mW; Package Quantity: 1; Features: Automotive AEC-Q200; Termination: SMD/SMT; Voltage Rating: 75V; Resistance Tolerance: 1%; Construction: Rectangular; Technology: THICK FILM; Working Voltage: 75V; Length: 1.6mm; Width: 0.8mm; Height: 0.022inch; Depth: 0.8mm; Ratings: AEC-Q200; Radiation Hardening: No; RoHS Compliant: Yes; Lead Free: Lead Free; Military Standard: Not; Reach SVHC Compliant: Yes; ComponentLink1URL: https://datasheet.ciiva.com/16770/70260748-16770860.pdf?src-supplier=Allied+Electronics; ComponentLink1Description: https://datasheet.ciiva.com/16770/70260748-16770860.pdf?src-supplier=Allied+Electronics; ComponentLink2URL: https://datasheet.ciiva.com/9192/aoa0000ce2-9192958.pdf?src-supplier=Avnet; ComponentLink2Description: https://datasheet.ciiva.com/9192/aoa0000ce2-9192958.pdf?src-supplier=Avnet; ComponentLink3URL: https://datasheet.ciiva.com/30238/aoa0000ce2-30238940.pdf?src-supplier=Onlinecomponents.com; ComponentLink3Description: https://datasheet.ciiva.com/30238/aoa0000ce2-30238940.pdf?src-supplier=Onlinecomponents.com; ComponentLink4URL: https://datasheet.ciiva.com/5915/aoa0000ce2-5915293.pdf?src-supplier=Farnell; ComponentLink4Description: https://datasheet.ciiva.com/5915/aoa0000ce2-5915293.pdf?src-supplier=Farnell; ComponentLink5URL: https://datasheet.ciiva.com/46373/1678782-46373801.pdf?src-supplier=Element14; ComponentLink5Description: https://datasheet.ciiva.com/46373/1678782-46373801.pdf?src-supplier=Element14; ComponentLink6URL: https://datasheet.ciiva.com/22682/1678782-22682189.pdf?src-supplier=Element14; ComponentLink6Description: https://datasheet.ciiva.com/22682/1678782-22682189.pdf?src-supplier=Element14; ComponentLink7URL: https://datasheet.ciiva.com/46373/1678782-46373800.pdf?src-supplier=Element14; ComponentLink7Description: https://datasheet.ciiva.com/46373/1678782-46373800.pdf?src-supplier=Element14; Supplier Part Number 1: P15.0HCT-ND
SW1 = EG1215AA: Switch Slide ON ON SPDT Side Slide 0.3A 6VDC 10000Cycles Gull Wing SMD T/R; Manufacturer: ITT C&K; Manufacturer Part Number: PCM12SMTR; this part is design: alperen; Actuator Material: Nylon,Polyamide,PA46; Switch Function: On-On; Actuator Type: Standard; Voltage Rating (DC): 6V; Current Rating: 300mA; Switch Travel: 1.5mm; Contact Resistance: 70mR; Insulation Resistance: 100mR; Supplier 1: Digi-Key; RoHS: Yes; Category: Slide Switches; Stock 1: 35407; Pricing 1: 1=0.97000, 10=0.93100, 25=0.87000, 100=0.75550, 250=0.68744, 500=0.63732, 1000=0.59078 (USD); Mount: Surface Mount; Contact Plating: Silver; Contact Material: Copper Alloy,Silver,Copper; Mechanical Life: 10000Cycles; Min Operating Temperature: -20°C; Max Operating Temperature: 85°C; Packaging: Tape and Reel; Throw Configuration: SPDT; Termination: Gull Wing; Orientation: Right Angle; Series: PCM; Package Quantity: 3500; Max Voltage Rating (DC): 6V; Contact Current Rating: 300mA; Max Current Rating: 300mA; Voltage Rating (AC): 6V; Length: 7.7mm; Width: 6.7mm; Actuator Length: 1.5mm; Depth: 5mm; RoHS Compliant: Yes; Lead Free: Lead Free; Reach SVHC Compliant: Yes; ComponentLink1URL: https://datasheet.ciiva.com/5279/pcm-5oct11-24112-5279535.pdf?src-supplier=Mouser; ComponentLink1Description: https://datasheet.ciiva.com/5279/pcm-5oct11-24112-5279535.pdf?src-supplier=Mouser; ComponentLink2URL: https://datasheet.ciiva.com/1532/1685524-1532411.pdf?src-supplier=Element14; ComponentLink2Description: https://datasheet.ciiva.com/1532/1685524-1532411.pdf?src-supplier=Element14; ComponentLink3URL: https://datasheet.ciiva.com/16174/pcm-30mar11-16174552.pdf?src-supplier=Onlinecomponents.com; ComponentLink3Description: https://datasheet.ciiva.com/16174/pcm-30mar11-16174552.pdf?src-supplier=Onlinecomponents.com; ComponentLink4URL: https://datasheet.ciiva.com/16475/pcm12smtr-16475766.pdf?src-supplier=Future+Electronics; ComponentLink4Description: https://datasheet.ciiva.com/16475/pcm12smtr-16475766.pdf?src-supplier=Future+Electronics; ComponentLink5URL: https://datasheet.ciiva.com/2889/pcm-13nov13-2889155.pdf?src-supplier=Digi-Key; ComponentLink5Description: https://datasheet.ciiva.com/2889/pcm-13nov13-2889155.pdf?src-supplier=Digi-Key; ComponentLink6URL: https://datasheet.ciiva.com/2889/pcm-13nov13-2889154.pdf?src-supplier=Digi-Key; ComponentLink6Description: https://datasheet.ciiva.com/2889/pcm-13nov13-2889154.pdf?src-supplier=Digi-Key; ComponentLink7URL: https://datasheet.ciiva.com/2889/pcm-13nov13-2889156.pdf?src-supplier=Digi-Key; ComponentLink7Description: https://datasheet.ciiva.com/2889/pcm-13nov13-2889156.pdf?src-supplier=Digi-Key; Supplier Part Number 1: 401-2016-1-ND
U3 = ESP32-WROOM-32E-N4: Rx Txrx Mod Wifi Trace Ant SMD; Manufacturer: Espressif Systems; Manufacturer Part Number: ESP32-WROOM-32E(M113EH3200PH3Q0); this part is design: alperen; Supply Voltage-Nom: 3V3; Supplier 1: Digi-Key; RoHS: No; Category: RF Receivers, Transceivers; Stock 1: 18200; Pricing 1: 650=3.00000 (USD); Min Operating Temperature: -40; Max Operating Temperature: 85; ComponentLink1Description: DATASHEET; ComponentLink1URL: https://www.espressif.com/sites/default/files/documentation/esp32-wroom-32e_esp32-wroom-32ue_datasheet_en.pdf; Case/Package: ESP32-32E; Supplier Part Number 1: 1965-ESP32-WROOM-32E-N4TR-ND
U4 = M41T00M6F: Real-time Clocks Clock/Calendar I2C, 2-Wire Serial 70uA @ 2V ~ 5.5V SOIC-8_150mil RoHS; Manufacturer: STMicroelectronics; this part is design: alperen; Non-volatile Memory Size: 8B; Interface: I2C,Serial,2-Wire; Logic Function: Clock; Time Format: HH:MM:SS; Date Format: YY-MM-DD-dd; Supplier 1: Digi-Key; Manufacturer Part Number: M41T00M6F; RoHS: Yes; Category: Real Time Clocks; Pricing 1: 1=3.96000, 10=3.55600, 25=3.36160, 100=2.91340, 250=2.76404, 500=2.48016, 1000=2.46662 (USD); Mount: Surface Mount; Case/Package: SOIC; Number of Pins: 8; Weight: 0.019048oz; Min Operating Temperature: -40°C; Max Operating Temperature: 85°C; Max Supply Voltage: 5.5V; Min Supply Voltage: 2V; Packaging: Tape and Reel; Package Quantity: 2500; Memory Size: 8B; RAM Size: 8B; Series: -; Supply Voltage-Nom: 5.5V; Length: 5mm; Width: 4mm; Height: 1.5mm; Radiation Hardening: No; Reach SVHC Compliant: Yes; Lead Free: Lead Free; Temperature Grade: INDUSTRIAL; RoHS Compliant: Yes; ComponentLink1URL: https://datasheet.ciiva.com/16213/cd00001542-16213654.pdf?src-supplier=Future+Electronics; ComponentLink1Description: https://datasheet.ciiva.com/16213/cd00001542-16213654.pdf?src-supplier=Future+Electronics; ComponentLink2URL: https://datasheet.ciiva.com/7630/1837112-7630077.pdf?src-supplier=Element14; ComponentLink2Description: https://datasheet.ciiva.com/7630/1837112-7630077.pdf?src-supplier=Element14; ComponentLink3URL: https://datasheet.ciiva.com/41459/001185345-da-01-en-ic-rtc-srl-512kbit-m41t00m6f-soic-8-stm-41459818.pdf?src-supplier=Conrad; ComponentLink3Description: https://datasheet.ciiva.com/41459/001185345-da-01-en-ic-rtc-srl-512kbit-m41t00m6f-soic-8-stm-41459818.pdf?src-supplier=Conrad
U5 = MAX662MSA+: Temp Sensor Digital Serial (3-Wire, SPI) 8-Pin SOIC N Tube; Manufacturer: Maxim; Manufacturer Part Number: MAX6662MSA+; this part is design: alperen; Output Type: Digital,SPI; Max Supply Voltage (DC): 5.5V; Min Supply Voltage (DC): 3V; Resolution: 12b; Max Power Dissipation: 471mW; Operating Supply Current: 600uA; Number of Bits: 12; Supplier 1: Farnell; RoHS: Yes; Category: Temperature and Humidity Sensors; Stock 1: 452; Pricing 1: 1=5.47000, 10=4.27000, 25=3.46000, 100=2.98000, 300=2.74000, 500=2.50000, 2500=2.34000, 5000=2.22000 (EUR); Case/Package: SOIC; Number of Pins: 8; Min Operating Temperature: -55°C; Max Operating Temperature: 150°C; Interface: SPI; Packaging: Rail/Tube; Package Quantity: 100; Series: -; Max Supply Voltage: 5.5V; Min Supply Voltage: 3V; Length: 5mm; Width: 4mm; Height: 1.5mm; Radiation Hardening: No; RoHS Compliant: Yes; Lead Free: Lead Free; ComponentLink1URL: https://datasheet.ciiva.com/5299/max6662-89142-5299456.pdf?src-supplier=Mouser; ComponentLink1Description: https://datasheet.ciiva.com/5299/max6662-89142-5299456.pdf?src-supplier=Mouser; ComponentLink2URL: https://datasheet.ciiva.com/3277/max6662-3277979.pdf?src-supplier=Avnet; ComponentLink2Description: https://datasheet.ciiva.com/3277/max6662-3277979.pdf?src-supplier=Avnet; ComponentLink3URL: https://datasheet.ciiva.com/2003/max6662-2003390.pdf?src-supplier=Digi-Key; ComponentLink3Description: https://datasheet.ciiva.com/2003/max6662-2003390.pdf?src-supplier=Digi-Key; Supplier Part Number 1: 2515569
U6 = Component_1: TVS DIODE 5.25VWM 17VC SOT23-6; this part is designed: alperen; Manufacturer: STMicroelectronics; Direction: Unidirectional,Bidirectional; Capacitance: 3.5pF; Operating Supply Voltage: 1.1V; Number of Channels: 2; Breakdown Voltage: 6V; Clamping Voltage: 17V; Reverse Standoff Voltage: 5.25V; Power Line Protection: Yes; Test Current: 1mA; Max Reverse Leakage Current: 150nA; Peak Pulse Current: 5A; Element Configuration: Dual; Data Rate: 480Mbps; Number of Elements: 1; Working Voltage: 5V; Supplier 1: Digi-Key; Manufacturer Part Number: USBLC6-2SC6; RoHS: Yes; Category: TVS Diodes; Stock 1: 126703; Pricing 1: 1=0.61000, 10=0.52200, 100=0.38970, 500=0.30620, 1000=0.23660 (USD); Mount: Surface Mount; Case/Package: SOT-23; Number of Pins: 6; Contact Plating: Tin,Matte; Min Operating Temperature: -40°C; Max Operating Temperature: 125°C; Packaging: Tape and Reel; Package Quantity: 3000; Termination: SMD/SMT; Number of Bidirectional Channels: 2; Min Breakdown Voltage: 6V; ESD Protection: Yes; Leakage Current: 150nA; Series: USB; Reverse Breakdown Voltage: 6V; Polarity: Unidirectional,Bidirectional; Max Breakdown Voltage: 6V; Clamping Voltage-Max: 17V; Length: 3.05mm; Width: 1.75mm; Height: 1.3mm; Depth: 1.75mm; Radiation Hardening: No; Reach SVHC Compliant: Yes; Lead Free: Lead Free; RoHS Compliant: Yes; ComponentLink1URL: https://datasheet.ciiva.com/1268/1690354-1268384.pdf?src-supplier=Element14; ComponentLink1Description: https://datasheet.ciiva.com/1268/1690354-1268384.pdf?src-supplier=Element14; ComponentLink2URL: https://datasheet.ciiva.com/4508/cd00050750-113117-4508433.pdf?src-supplier=Mouser; ComponentLink2Description: https://datasheet.ciiva.com/4508/cd00050750-113117-4508433.pdf?src-supplier=Mouser; ComponentLink3URL: https://datasheet.ciiva.com/15143/getdatasheetpartid-148465-15143789.pdf?src-supplier=Verical; ComponentLink3Description: https://datasheet.ciiva.com/15143/getdatasheetpartid-148465-15143789.pdf?src-supplier=Verical; ComponentLink4URL: https://datasheet.ciiva.com/16200/cd00050750-16200026.pdf?src-supplier=Future+Electronics; ComponentLink4Description: https://datasheet.ciiva.com/16200/cd00050750-16200026.pdf?src-supplier=Future+Electronics; ComponentLink5URL: https://datasheet.ciiva.com/41444/001184109-da-01-en-ic-esd-protecti-usblc6-2sc6-sot-23-6-stm-41444156.pdf?src-supplier=Conrad; ComponentLink5Description: https://datasheet.ciiva.com/41444/001184109-da-01-en-ic-esd-protecti-usblc6-2sc6-sot-23-6-stm-41444156.pdf?src-supplier=Conrad; Supplier Part Number 1: 497-5235-1-ND
U7 = STM32F103C6T6A: MCU 32-bit STM32F ARM Cortex M3 RISC 32KB Flash 2.5V/3.3V 48-Pin LQFP Tray; Manufacturer: STMicroelectronics; this part is design: alperen; Number of Timers/Counters: 3; Max Supply Voltage: 3.6V; Frequency: 72MHz; Interface: I2C,SPI,USART; RAM Size: 10KB; Max Power Dissipation: 363mW; Number of I/Os: 37; Min Supply Voltage: 2V; Oscillator Type: Internal; Data Bus Width: 32b; Watchdog Timer: Yes; Peripherals: POR,PWM,WDT,DMA,Temp Sensor,I2C; Number of ADC Channels: 10; Number of SPI Channels: 1; Supplier 1: Digi-Key; Manufacturer Part Number: STM32F103C6T6A; RoHS: Yes; Category: Microcontrollers; Stock 1: 1295; Pricing 1: 1=6.61000, 10=5.93900, 25=5.61440, 80=4.86588, 250=4.61640, 500=4.14228, 1000=3.49349, 2500=3.40275 (USD); Case/Package: LQFP; Number of Pins: 48; Weight: 0.006409oz; Min Operating Temperature: -40°C; Max Operating Temperature: 85°C; Package Quantity: 1500; Packaging: Tray; Series: STM32F103C6; Max Frequency: 72MHz; Number of Programmable I/O: 37; Memory Type: FLASH; Memory Size: 32KB; Core Architecture: ARM; Number of I2C Channels: 1; Address Bus Width: 32b; Length: 7mm; Width: 7mm; Height: 1.4mm; Radiation Hardening: No; Lead Free: Lead Free; Reach SVHC Compliant: Yes; RoHS Compliant: Yes; ComponentLink1URL: https://datasheet.ciiva.com/15122/getdatasheetpartid-69879-15122075.pdf?src-supplier=Verical; ComponentLink1Description: https://datasheet.ciiva.com/15122/getdatasheetpartid-69879-15122075.pdf?src-supplier=Verical; ComponentLink2URL: https://datasheet.ciiva.com/14100/pustm-arm-microcont-stm32f103-en-14100507.pdf?src-supplier=Distrelec; ComponentLink2Description: https://datasheet.ciiva.com/14100/pustm-arm-microcont-stm32f103-en-14100507.pdf?src-supplier=Distrelec; Supplier Part Number 1: 497-11515-ND
X1 = CYRSTAL 16MHz: Crystal 16MHz ±30ppm (Tol) ±50ppm (Stability) 20pF FUND 50Ohm 4-Pin Mini-SMD T/R; this part is designed: alperen; Manufacturer: ECS International; ESR (Equivalent Series Resistance): 50R; Supplier 1: Digi-Key; Manufacturer Part Number: ECS-160-20-30B-TR; RoHS: Yes; Category: Crystals; Stock 1: 29565; Pricing 1: 1=1.34000, 10=1.28100, 50=1.25140, 100=1.07260, 500=1.04282 (USD); Mount: Surface Mount; Case/Package: SMD/SMT; Min Operating Temperature: -20°C; Max Operating Temperature: 70°C; Package Quantity: 1; Frequency Tolerance: 30ppm; Load Capacitance: 20pF; Packaging: Tape and Reel; Frequency Stability: 50ppm; Tolerance: 50ppm; Termination: SMD/SMT; Series: ECX-53B; Length: 0.197inch; Width: 0.126inch; Height: 0.033inch; Lead Free: Lead Free; RoHS Compliant: Yes; ComponentLink1URL: https://datasheet.ciiva.com/853/ecx-53b-853408.pdf?src-supplier=Digi-Key; ComponentLink1Description: https://datasheet.ciiva.com/853/ecx-53b-853408.pdf?src-supplier=Digi-Key; ComponentLink2URL: https://datasheet.ciiva.com/853/ecx-53b-853407.pdf?src-supplier=Digi-Key; ComponentLink2Description: https://datasheet.ciiva.com/853/ecx-53b-853407.pdf?src-supplier=Digi-Key; ComponentLink3URL: https://datasheet.ciiva.com/853/ecx-53b-853406.pdf?src-supplier=Digi-Key; ComponentLink3Description: https://datasheet.ciiva.com/853/ecx-53b-853406.pdf?src-supplier=Digi-Key; Supplier Part Number 1: XC1120CT-ND
Y1 = CYRISTAL32768kHZ: Crystal 0.032768MHz ±20ppm (Tol) 12.5pF Flexural 90000Ohm 2-Pin CSMD T/R; Manufacturer: Abracon; this part is design: alperen; ESR (Equivalent Series Resistance): 90kR; Supplier 1: Digi-Key; Manufacturer Part Number: ABS05-32.768KHZ-T; RoHS: Yes; Category: Crystals; Stock 1: 374062; Pricing 1: 1=0.66000, 10=0.58100, 50=0.54340, 100=0.48020, 500=0.45494, 1000=0.37911 (USD); Mount: Surface Mount; Case/Package: CSMD; Number of Pins: 2; Min Operating Temperature: -40°C; Max Operating Temperature: 85°C; Packaging: Tape and Reel; Frequency Tolerance: 20ppm; Load Capacitance: 12.5pF; Package Quantity: 3000; Tolerance: 20ppm; Termination: SMD/SMT; Series Resistance: 90kR; Series: ABS05; Operating Frequency: 32.768 kHz; Length: 1.6mm; Width: 1mm; Height: 0.5mm; Depth: 1mm; Radiation Hardening: No; Reach SVHC Compliant: Yes; Lead Free: Lead Free; RoHS Compliant: Yes; ComponentLink1URL: https://datasheet.ciiva.com/23810/abs05-23810480.pdf?src-supplier=Newark; ComponentLink1Description: https://datasheet.ciiva.com/23810/abs05-23810480.pdf?src-supplier=Newark; ComponentLink2URL: https://datasheet.ciiva.com/6728/abs05-6728949.pdf?src-supplier=Digi-Key; ComponentLink2Description: https://datasheet.ciiva.com/6728/abs05-6728949.pdf?src-supplier=Digi-Key; ComponentLink3URL: https://datasheet.ciiva.com/6728/abs05-6728950.pdf?src-supplier=Digi-Key; ComponentLink3Description: https://datasheet.ciiva.com/6728/abs05-6728950.pdf?src-supplier=Digi-Key; ComponentLink4URL: https://datasheet.ciiva.com/16411/abs05-16411149.pdf?src-supplier=Future+Electronics; ComponentLink4Description: https://datasheet.ciiva.com/16411/abs05-16411149.pdf?src-supplier=Future+Electronics; Supplier Part Number 1: 535-11899-1-ND